# Altium project GUITAR.PrjPCB
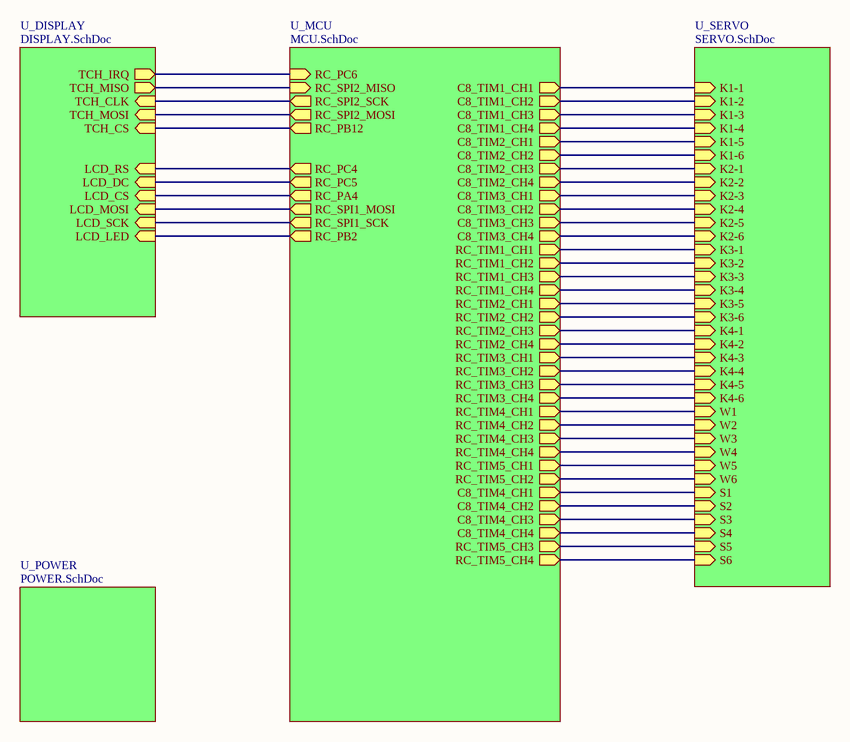
[diagram p0: CONN.SchDoc]
5 sheets, 103 parts. Net scope: hierarchical (ports join the sheet entries above them; power ports are global).
Board file: GUITAR.PcbDoc
Sheets:
  CONN.SchDoc
    U_DISPLAY = DISPLAY.SchDoc
    U_MCU = MCU.SchDoc
    U_POWER = POWER.SchDoc
    U_SERVO = SERVO.SchDoc

## Sheet CONN.SchDoc: =ProjectName
size A4; CheckedBy: DatNB; Author: Ven; CompanyName: Nacentech; Organization: IMET

### Sub-sheets
U_DISPLAY = DISPLAY.SchDoc: TCH_CLK (in), TCH_MISO (out), TCH_IRQ (out), LCD_MOSI (in), LCD_RS (in), LCD_DC (in), LCD_SCK (in), LCD_LED (in), TCH_MOSI (in), TCH_CS (in), LCD_CS (in)
U_MCU = MCU.SchDoc: RC_TIM3_CH4 (out), RC_SPI2_SCK (out), RC_SPI1_MOSI (out), C8_TIM3_CH3 (out), RC_PA4 (out), RC_PB2 (out), RC_TIM2_CH4 (out), C8_TIM3_CH1 (out), RC_TIM4_CH1 (out), RC_PC5 (out), RC_TIM5_CH4 (out), C8_TIM1_CH4 (out), RC_TIM3_CH2 (out), RC_PC4 (out), RC_TIM5_CH1 (out), C8_TIM1_CH1 (out), RC_PC6 (in), C8_TIM2_CH2 (out), RC_SPI2_MOSI (out), RC_SPI1_SCK (out), RC_TIM4_CH3 (out), RC_TIM2_CH2 (out), RC_TIM4_CH2 (out), C8_TIM1_CH3 (out), RC_TIM3_CH3 (out), RC_TIM4_CH4 (out), RC_TIM3_CH1 (out), RC_TIM5_CH3 (out), RC_PB12 (out), C8_TIM1_CH2 (out), C8_TIM2_CH3 (out), C8_TIM2_CH4 (out), C8_TIM3_CH2 (out), C8_TIM2_CH1 (out), C8_TIM3_CH4 (out), C8_TIM4_CH4 (out), C8_TIM4_CH2 (out), C8_TIM4_CH1 (out), C8_TIM4_CH3 (out), RC_TIM1_CH2 (out), RC_TIM1_CH3 (out), RC_TIM1_CH4 (out), RC_TIM1_CH1 (out), RC_TIM2_CH3 (out), RC_TIM2_CH1 (out), RC_TIM5_CH2 (out), RC_SPI2_MISO (in)
U_POWER = POWER.SchDoc: no entries
U_SERVO = SERVO.SchDoc: K1-1 (in), K1-2 (in), K1-3 (in), K1-4 (in), K1-5 (in), K1-6 (in), K2-1 (in), K2-2 (in), K2-3 (in), K2-4 (in), K2-5 (in), K2-6 (in), K3-1 (in), K3-2 (in), K3-3 (in), K3-4 (in), K3-5 (in), K3-6 (in), K4-1 (in), K4-2 (in), K4-3 (in), K4-4 (in), K4-5 (in), K4-6 (in), W1 (in), W2 (in), W3 (in), W4 (in), W5 (in), W6 (in), S1 (in), S2 (in), S3 (in), S4 (in), S5 (in), S6 (in)

### Nets
NetJ7_1: sheet U_MCU/C8_TIM1_CH2, sheet U_SERVO/K1-2
NetJ7_6: sheet U_MCU/C8_TIM1_CH1, sheet U_SERVO/K1-1
NetJ8_1: sheet U_MCU/C8_TIM1_CH4, sheet U_SERVO/K1-4
NetJ8_6: sheet U_MCU/C8_TIM1_CH3, sheet U_SERVO/K1-3
NetJ9_1: sheet U_MCU/C8_TIM2_CH2, sheet U_SERVO/K1-6
NetJ9_6: sheet U_MCU/C8_TIM2_CH1, sheet U_SERVO/K1-5
NetJ10_1: sheet U_MCU/C8_TIM2_CH4, sheet U_SERVO/K2-2
NetJ10_6: sheet U_MCU/C8_TIM2_CH3, sheet U_SERVO/K2-1
NetJ11_1: sheet U_MCU/C8_TIM3_CH2, sheet U_SERVO/K2-4
NetJ11_6: sheet U_MCU/C8_TIM3_CH1, sheet U_SERVO/K2-3
NetJ12_1: sheet U_MCU/C8_TIM4_CH2, sheet U_SERVO/S2
NetJ12_6: sheet U_MCU/C8_TIM4_CH1, sheet U_SERVO/S1
NetJ13_1: sheet U_MCU/C8_TIM3_CH4, sheet U_SERVO/K2-6
NetJ13_6: sheet U_MCU/C8_TIM3_CH3, sheet U_SERVO/K2-5
NetJ14_1: sheet U_MCU/RC_TIM1_CH2, sheet U_SERVO/K3-2
NetJ14_6: sheet U_MCU/RC_TIM1_CH1, sheet U_SERVO/K3-1
NetJ15_1: sheet U_MCU/RC_TIM1_CH4, sheet U_SERVO/K3-4
NetJ15_6: sheet U_MCU/RC_TIM1_CH3, sheet U_SERVO/K3-3
NetJ16_1: sheet U_MCU/RC_TIM2_CH2, sheet U_SERVO/K3-6
NetJ16_6: sheet U_MCU/RC_TIM2_CH1, sheet U_SERVO/K3-5
NetJ17_1: sheet U_MCU/RC_TIM2_CH4, sheet U_SERVO/K4-2
NetJ17_6: sheet U_MCU/RC_TIM2_CH3, sheet U_SERVO/K4-1
NetJ18_1: sheet U_MCU/C8_TIM4_CH4, sheet U_SERVO/S4
NetJ18_6: sheet U_MCU/C8_TIM4_CH3, sheet U_SERVO/S3
NetJ19_1: sheet U_MCU/RC_TIM3_CH2, sheet U_SERVO/K4-4
NetJ19_6: sheet U_MCU/RC_TIM3_CH1, sheet U_SERVO/K4-3
NetJ20_1: sheet U_MCU/RC_TIM3_CH4, sheet U_SERVO/K4-6
NetJ20_6: sheet U_MCU/RC_TIM3_CH3, sheet U_SERVO/K4-5
NetJ21_1: sheet U_MCU/RC_TIM4_CH2, sheet U_SERVO/W2
NetJ21_6: sheet U_MCU/RC_TIM4_CH1, sheet U_SERVO/W1
NetJ22_1: sheet U_MCU/RC_TIM4_CH4, sheet U_SERVO/W4
NetJ22_6: sheet U_MCU/RC_TIM4_CH3, sheet U_SERVO/W3
NetJ23_1: sheet U_MCU/RC_TIM5_CH2, sheet U_SERVO/W6
NetJ23_6: sheet U_MCU/RC_TIM5_CH1, sheet U_SERVO/W5
NetJ24_1: sheet U_MCU/RC_TIM5_CH4, sheet U_SERVO/S6
NetJ24_6: sheet U_MCU/RC_TIM5_CH3, sheet U_SERVO/S5
NetJP1_3: sheet U_DISPLAY/LCD_CS, sheet U_MCU/RC_PA4
NetJP1_4: sheet U_DISPLAY/LCD_RS, sheet U_MCU/RC_PC4
NetJP1_5: sheet U_DISPLAY/LCD_DC, sheet U_MCU/RC_PC5
NetJP1_6: sheet U_DISPLAY/LCD_MOSI, sheet U_MCU/RC_SPI1_MOSI
NetJP1_7: sheet U_DISPLAY/LCD_SCK, sheet U_MCU/RC_SPI1_SCK
NetJP1_8: sheet U_DISPLAY/LCD_LED, sheet U_MCU/RC_PB2
NetJP2_1: sheet U_DISPLAY/TCH_CLK, sheet U_MCU/RC_SPI2_SCK
NetJP2_2: sheet U_DISPLAY/TCH_CS, sheet U_MCU/RC_PB12
NetJP2_3: sheet U_DISPLAY/TCH_MOSI, sheet U_MCU/RC_SPI2_MOSI
NetJP2_4: sheet U_DISPLAY/TCH_MISO, sheet U_MCU/RC_SPI2_MISO
NetJP2_5: sheet U_DISPLAY/TCH_IRQ, sheet U_MCU/RC_PC6

### Notes on the sheet
- Project:
- Page Contents:
- Size:
- Date:
- A4
- Checked by:
- Time:
- Revision:
- Sheet
- of
- File:

## Sheet DISPLAY.SchDoc: =ProjectName
size A4; CheckedBy: DatNB; Author: Ven; CompanyName: Nacentech; Organization: IMET
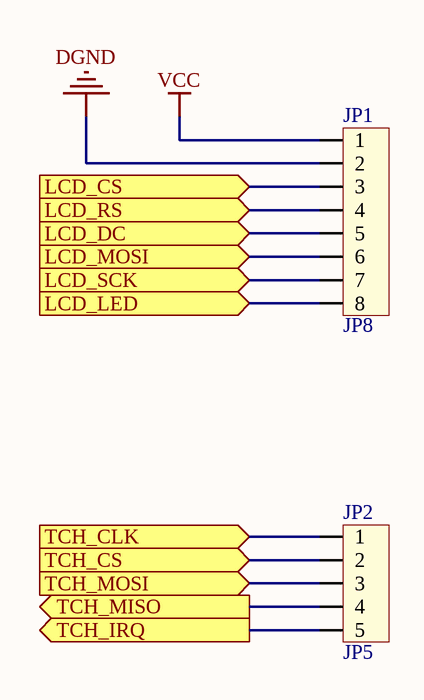
[diagram p1: DISPLAY.SchDoc]

### Parts
JP1  JP8  [CON8]
JP2  JP5  [CON5]

### Ports
LCD_CS (in), LCD_DC (in), LCD_LED (in), LCD_MOSI (in), LCD_RS (in), LCD_SCK (in), TCH_CLK (in), TCH_CS (in), TCH_IRQ (out), TCH_MISO (out), TCH_MOSI (in)

### Nets
DGND: JP1.2
VCC: JP1.1
NetJP1_3: JP1.3 ; port LCD_CS
NetJP1_4: JP1.4 ; port LCD_RS
NetJP1_5: JP1.5 ; port LCD_DC
NetJP1_6: JP1.6 ; port LCD_MOSI
NetJP1_7: JP1.7 ; port LCD_SCK
NetJP1_8: JP1.8 ; port LCD_LED
NetJP2_1: JP2.1 ; port TCH_CLK
NetJP2_2: JP2.2 ; port TCH_CS
NetJP2_3: JP2.3 ; port TCH_MOSI
NetJP2_4: JP2.4 ; port TCH_MISO
NetJP2_5: JP2.5 ; port TCH_IRQ

### Notes on the sheet
- Project:
- Page Contents:
- Size:
- Date:
- A4
- Checked by:
- Time:
- Revision:
- Sheet
- of
- File:

### Library data of the parts
JP1 = Con8: Connector 8; Value: Connector 8
JP2 = Con5: Connector 5; Value: Connector 5

## Sheet MCU.SchDoc: =ProjectName
size A3; Author: Ven
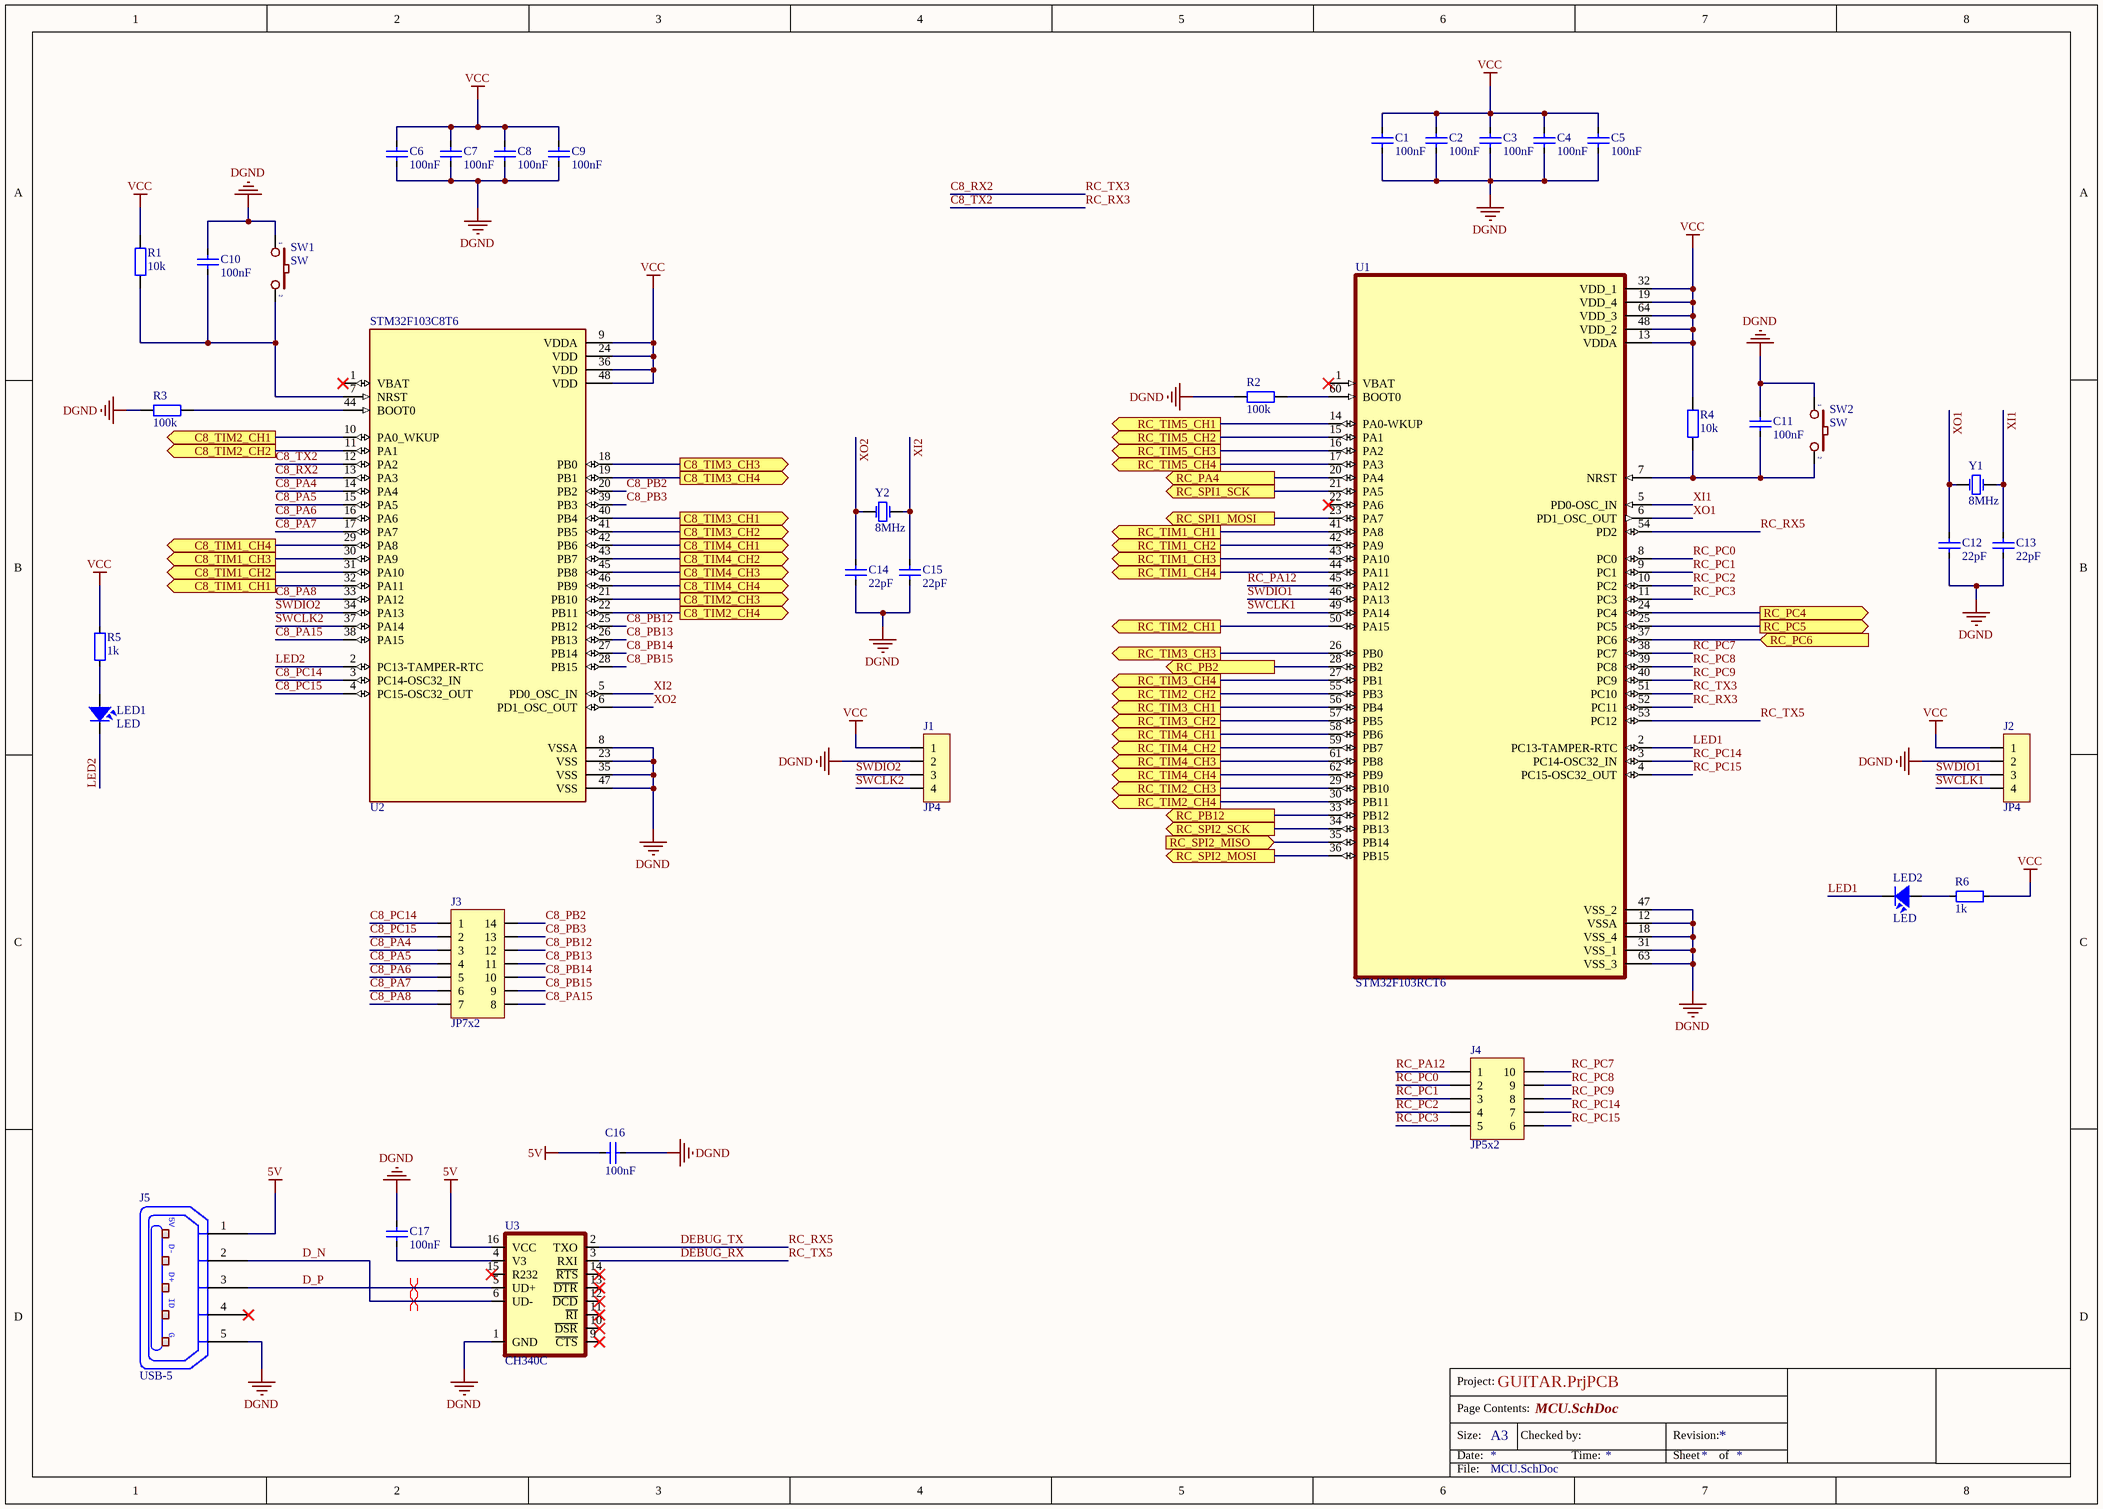
[diagram p2: MCU.SchDoc]

### Parts
C1  100nF  [CAP_0805]
C2  100nF  [CAP_0805]
C3  100nF  [CAP_0805]
C4  100nF  [CAP_0805]
C5  100nF  [CAP_0805]
C6  100nF  [CAP_0805]
C7  100nF  [CAP_0805]
C8  100nF  [CAP_0805]
C9  100nF  [CAP_0805]
C10  100nF  [CAP_0805]
C11  100nF  [CAP_0805]
C12  22pF  [CAP_0805]
C13  22pF  [CAP_0805]
C14  22pF  [CAP_0805]
C15  22pF  [CAP_0805]
C16  100nF  [CAP_0805]
C17  100nF  [CAP_0805]
J1  JP4  [JP4-C1T]
J2  JP4  [JP4-C1T]
J3  JP7x2  [JP7-D2T]
J4  JP5x2  [JP5-D2T]
J5  USB-5  [USB-M1]
LED1  LED  [LED-0805-Green]
LED2  LED  [LED-0805-Green]
R1  10k  [RES-SMD-0805]
R2  100k  [RES-SMD-0805]
R3  100k  [RES-SMD-0805]
R4  10k  [RES-SMD-0805]
R5  1k  [RES-SMD-0805]
R6  1k  [RES-SMD-0805]
SW1  SW  [SW 3x2x4]
SW2  SW  [SW 3x2x4]
U1  STM32F103RCT6  [QFP50P1200X1200X160-64N]
U2  STM32F103C8T6  [LQFP 48]
U3  CH340C  [SO016]
Y1  8MHz  [XTAL 5032 SMD]
Y2  8MHz  [XTAL 5032 SMD]

### Ports
C8_TIM1_CH1 (out), C8_TIM1_CH2 (out), C8_TIM1_CH3 (out), C8_TIM1_CH4 (out), C8_TIM2_CH1 (out), C8_TIM2_CH2 (out), C8_TIM2_CH3 (out), C8_TIM2_CH4 (out), C8_TIM3_CH1 (out), C8_TIM3_CH2 (out), C8_TIM3_CH3 (out), C8_TIM3_CH4 (out), C8_TIM4_CH1 (out), C8_TIM4_CH2 (out), C8_TIM4_CH3 (out), C8_TIM4_CH4 (out), RC_PA4 (out), RC_PB2 (out), RC_PB12 (out), RC_PC4 (out), RC_PC5 (out), RC_PC6 (in), RC_SPI1_MOSI (out), RC_SPI1_SCK (out), RC_SPI2_MISO (in), RC_SPI2_MOSI (out), RC_SPI2_SCK (out), RC_TIM1_CH1 (out), RC_TIM1_CH2 (out), RC_TIM1_CH3 (out), RC_TIM1_CH4 (out), RC_TIM2_CH1 (out), RC_TIM2_CH2 (out), RC_TIM2_CH3 (out), RC_TIM2_CH4 (out), RC_TIM3_CH1 (out), RC_TIM3_CH2 (out), RC_TIM3_CH3 (out), RC_TIM3_CH4 (out), RC_TIM4_CH1 (out), RC_TIM4_CH2 (out), RC_TIM4_CH3 (out), RC_TIM4_CH4 (out), RC_TIM5_CH1 (out), RC_TIM5_CH2 (out), RC_TIM5_CH3 (out), RC_TIM5_CH4 (out)

### Nets
5V: C16.2 J5.1(P1) U3.16(VCC)
DGND: C1.2 C2.2 C3.2 C4.2 C5.2 C6.2 C7.2 C8.2 C9.2 C10.1 C11.1 C12.1 C13.1 C14.1 C15.1 C16.1 C17.2 J1.2 J2.2 J5.5(P5) R2.1 R3.1 SW1.1 SW2.1 U1.12(VSSA) U1.18(VSS_4) U1.31(VSS_1) U1.47(VSS_2) U1.63(VSS_3) U2.8(VSSA) U2.23(VSS) U2.35(VSS) U2.47(VSS) U3.1(GND)
VCC: C1.1 C2.1 C3.1 C4.1 C5.1 C6.1 C7.1 C8.1 C9.1 J1.1 J2.1 R1.1 R4.1 R5.1 R6.1 U1.13(VDDA) U1.19(VDD_4) U1.32(VDD_1) U1.48(VDD_2) U1.64(VDD_3) U2.9(VDDA) U2.24(VDD) U2.36(VDD) U2.48(VDD)
C8_PA4: J3.3 U2.14(PA4)
C8_PA5: J3.4 U2.15(PA5)
C8_PA6: J3.5 U2.16(PA6)
C8_PA7: J3.6 U2.17(PA7)
C8_PA8: J3.7 U2.33(PA12)
C8_PA15: J3.8 U2.38(PA15)
C8_PB2: J3.14 U2.20(PB2)
C8_PB3: J3.13 U2.39(PB3)
C8_PB12: J3.12 U2.25(PB12)
C8_PB13: J3.11 U2.26(PB13)
C8_PB14: J3.10 U2.27(PB14)
C8_PB15: J3.9 U2.28(PB15)
C8_PC14: J3.1 U2.3(PC14-OSC32_IN)
C8_PC15: J3.2 U2.4(PC15-OSC32_OUT)
C8_RX2: U1.51(PC10) U2.13(PA3)  [also labelled RC_TX3]
C8_TX2: U1.52(PC11) U2.12(PA2)  [also labelled RC_RX3]
D_N: J5.2(P2) U3.6(UD-)
D_P: J5.3(P3) U3.5(UD+)
DEBUG_RX: U1.53(PC12) U3.3(RXI)  [also labelled RC_TX5]
DEBUG_TX: U1.54(PD2) U3.2(TXO)  [also labelled RC_RX5]
LED1: LED2.2 U1.2(PC13-TAMPER-RTC)
LED2: LED1.2 U2.2(PC13-TAMPER-RTC)
RC_PA12: J4.1 U1.45(PA12)
RC_PC0: J4.2 U1.8(PC0)
RC_PC1: J4.3 U1.9(PC1)
RC_PC2: J4.4 U1.10(PC2)
RC_PC3: J4.5 U1.11(PC3)
RC_PC7: J4.10 U1.38(PC7)
RC_PC8: J4.9 U1.39(PC8)
RC_PC9: J4.8 U1.40(PC9)
RC_PC14: J4.7 U1.3(PC14-OSC32_IN)
RC_PC15: J4.6 U1.4(PC15-OSC32_OUT)
SWCLK1: J2.4 U1.49(PA14)
SWCLK2: J1.4 U2.37(PA14)
SWDIO1: J2.3 U1.46(PA13)
SWDIO2: J1.3 U2.34(PA13)
XI1: C13.2 U1.5(PD0-OSC_IN) Y1.2(OSC2)
XI2: C15.2 U2.5(PD0_OSC_IN) Y2.2(OSC2)
XO1: C12.2 U1.6(PD1_OSC_OUT) Y1.1(OSC1)
XO2: C14.2 U2.6(PD1_OSC_OUT) Y2.1(OSC1)
NetC10_2: C10.2 R1.2 SW1.2 U2.7(NRST)
NetC11_2: C11.2 R4.2 SW2.2 U1.7(NRST)
NetC17_1: C17.1 U3.4(V3)
NetJ7_1: U2.31(PA10) ; port C8_TIM1_CH2
NetJ7_6: U2.32(PA11) ; port C8_TIM1_CH1
NetJ8_1: U2.29(PA8) ; port C8_TIM1_CH4
NetJ8_6: U2.30(PA9) ; port C8_TIM1_CH3
NetJ9_1: U2.11(PA1) ; port C8_TIM2_CH2
NetJ9_6: U2.10(PA0_WKUP) ; port C8_TIM2_CH1
NetJ10_1: U2.22(PB11) ; port C8_TIM2_CH4
NetJ10_6: U2.21(PB10) ; port C8_TIM2_CH3
NetJ11_1: U2.41(PB5) ; port C8_TIM3_CH2
NetJ11_6: U2.40(PB4) ; port C8_TIM3_CH1
NetJ12_1: U2.43(PB7) ; port C8_TIM4_CH2
NetJ12_6: U2.42(PB6) ; port C8_TIM4_CH1
NetJ13_1: U2.19(PB1) ; port C8_TIM3_CH4
NetJ13_6: U2.18(PB0) ; port C8_TIM3_CH3
NetJ14_1: U1.42(PA9) ; port RC_TIM1_CH2
NetJ14_6: U1.41(PA8) ; port RC_TIM1_CH1
NetJ15_1: U1.44(PA11) ; port RC_TIM1_CH4
NetJ15_6: U1.43(PA10) ; port RC_TIM1_CH3
NetJ16_1: U1.55(PB3) ; port RC_TIM2_CH2
NetJ16_6: U1.50(PA15) ; port RC_TIM2_CH1
NetJ17_1: U1.30(PB11) ; port RC_TIM2_CH4
NetJ17_6: U1.29(PB10) ; port RC_TIM2_CH3
NetJ18_1: U2.46(PB9) ; port C8_TIM4_CH4
NetJ18_6: U2.45(PB8) ; port C8_TIM4_CH3
NetJ19_1: U1.57(PB5) ; port RC_TIM3_CH2
NetJ19_6: U1.56(PB4) ; port RC_TIM3_CH1
NetJ20_1: U1.27(PB1) ; port RC_TIM3_CH4
NetJ20_6: U1.26(PB0) ; port RC_TIM3_CH3
NetJ21_1: U1.59(PB7) ; port RC_TIM4_CH2
NetJ21_6: U1.58(PB6) ; port RC_TIM4_CH1
NetJ22_1: U1.62(PB9) ; port RC_TIM4_CH4
NetJ22_6: U1.61(PB8) ; port RC_TIM4_CH3
NetJ23_1: U1.15(PA1) ; port RC_TIM5_CH2
NetJ23_6: U1.14(PA0-WKUP) ; port RC_TIM5_CH1
NetJ24_1: U1.17(PA3) ; port RC_TIM5_CH4
NetJ24_6: U1.16(PA2) ; port RC_TIM5_CH3
NetJP1_3: U1.20(PA4) ; port RC_PA4
NetJP1_4: U1.24(PC4) ; port RC_PC4
NetJP1_5: U1.25(PC5) ; port RC_PC5
NetJP1_6: U1.23(PA7) ; port RC_SPI1_MOSI
NetJP1_7: U1.21(PA5) ; port RC_SPI1_SCK
NetJP1_8: U1.28(PB2) ; port RC_PB2
NetJP2_1: U1.34(PB13) ; port RC_SPI2_SCK
NetJP2_2: U1.33(PB12) ; port RC_PB12
NetJP2_3: U1.36(PB15) ; port RC_SPI2_MOSI
NetJP2_4: U1.35(PB14) ; port RC_SPI2_MISO
NetJP2_5: U1.37(PC6) ; port RC_PC6
NetLED1_1: LED1.1 R5.2
NetLED2_1: LED2.1 R6.2
NetR2_2: R2.2 U1.60(BOOT0)
NetR3_2: R3.2 U2.44(BOOT0)

Not connected (* = marked no-connect by the designer): J5 4(P4)*; U1 1(VBAT)* 22(PA6)*; U2 1(VBAT)*; U3 9(~{CTS})* 10(~{DSR})* 11(~{RI})* 12(~{DCD})* 13(~{DTR})* 14(~{RTS})* 15(R232)*

### Layout directives
differential pair: D_N, D_P

### Notes on the sheet
- Project:
- Page Contents:
- Size:
- Date:
- A3
- Checked by:
- Time:
- Revision:
- Sheet
- of
- File:
- (in symbol USB-5) 5V; D-; D+; ID; G

### Library data of the parts
C1-C17 = CapSMD: Capacitor; Value: 33p; Published: 8-Jun-2000; LatestRevisionDate: 17-Jul-2002; LatestRevisionNote: Re-released for DXP Platform.; PackageReference: RAD-0.3; Publisher: Altium Limited
J1 J2 = JP4: WR-PHD 2.54 mm Angled Socket Header; Manufacturer: W¨¹rth Elektronik eiSos GmbH; partNo: 613004143121; ComponentLink1 Description: Manufacturer; ComponentLink2 Description: Datasheet; NoPins: 04; Created Date: 29 March 2013; ComponentLink1URL: http://www.we-online.com; ComponentLink2URL: http://katalog.we-online.de/em/datasheet/6130xx143121.pdf; Created by: Karrer Zheng
J3 = JP7x2: WR-PHD 2.54 mm Dual Socket Header; Manufacturer: W¨¹rth Elektronik eiSos GmbH; partNo: 61301421821; ComponentLink1 Description: Manufacturer; ComponentLink2 Description: Datasheet; NoPins: 14; Created Date: 29 March 2013; ComponentLink1URL: http://www.we-online.com; ComponentLink2URL: http://katalog.we-online.de/em/datasheet/6130xx21821.pdf; Created by: Karrer Zheng
J4 = JP5x2: WR-PHD 2.54 mm Dual Socket Header; Manufacturer: W¨¹rth Elektronik eiSos GmbH; partNo: 61301021821; ComponentLink1 Description: Manufacturer; ComponentLink2 Description: Datasheet; NoPins: 10; Created Date: 29 March 2013; ComponentLink1URL: http://www.we-online.com; ComponentLink2URL: http://katalog.we-online.de/em/datasheet/6130xx21821.pdf; Created by: Karrer Zheng
J5 = USB-5: Manufacturer: FCI; Manufacturer Part Number: 10118193-0001LF; Connector Type: USB - micro B; Number of Contacts: 5; Gender: Receptacle; Specifications: USB 2.0; .Creator: MM; .Checked PCB: RF; Supplier 1: Digi-Key; RoHS: RoHS Compliant; Category: Connectors, Interconnects; Stock 1: 28642; Pricing 1: 1=0.46, 10=0.433, 25=0.3712, 50=0.3156, 100=0.3032, 250=0.27224, 500=0.25988 (USD); Packaging: Cut Tape (CT); Mounting Type: Surface Mount, Right Angle, Horizontal; Features: Shielded, Solder Retention; Ingress Protection: -; ComponentLink1URL: http://portal.fciconnect.com/Comergent//fci/drawing/10118193.pdf; ComponentLink1Description: http://portal.fciconnect.com/Comergent//fci/drawing/10118193.pdf; Supplier Part Number 1: 609-4616-1-ND; .Checked SCH: MM
LED1 LED2 = LED: LED Single colour Green and Red; Value: LED 3 ly Single Colour
R1-R4 = Resistor - SMD: Resistor SMD; Manufacturer: Generic Components; Class: Passive; Published: 08/06/2000; Publisher: Altium Hobart Technology Centre
R5 R6 = Resistor - SMD: Resistor; Manufacturer: Generic Components; Class: Passive; Published: 08/06/2000; Publisher: Altium Hobart Technology Centre
SW1 SW2 = SW2: Switch button 2 pin; Value: SW chip 2 pin
U1 = STM32F103RCT6: STM32 ARM-based 32-bit MCU 72MHz 256KB
U2 = STM32F103C8T6: STM32 ARM-based 32-bit MCU with 64 Kbytes Flash, 64-pin LQFP, Industrial Temperature
U3 = CH340C: USB to serial chip CH340; MF: WCH; Package: Package; Check_prices: https://www.snapeda.com/parts/CH340C/WCH/view-part/5428851/?ref=eda; Value: *; Price: None; MP: CH340C; Availability: Unavailable; SnapEDA_Link: https://www.snapeda.com/parts/CH340C/WCH/view-part/5428851/?ref=snap
Y1 Y2 = XTAL: Crystal Oscillator; Published: 8-Jun-2000; LatestRevisionDate: 17-Jul-2002; LatestRevisionNote: Re-released for DXP Platform.; PackageReference: R38; Publisher: Altium Limited

## Sheet POWER.SchDoc: =ProjectName
size A3; Author: Ven
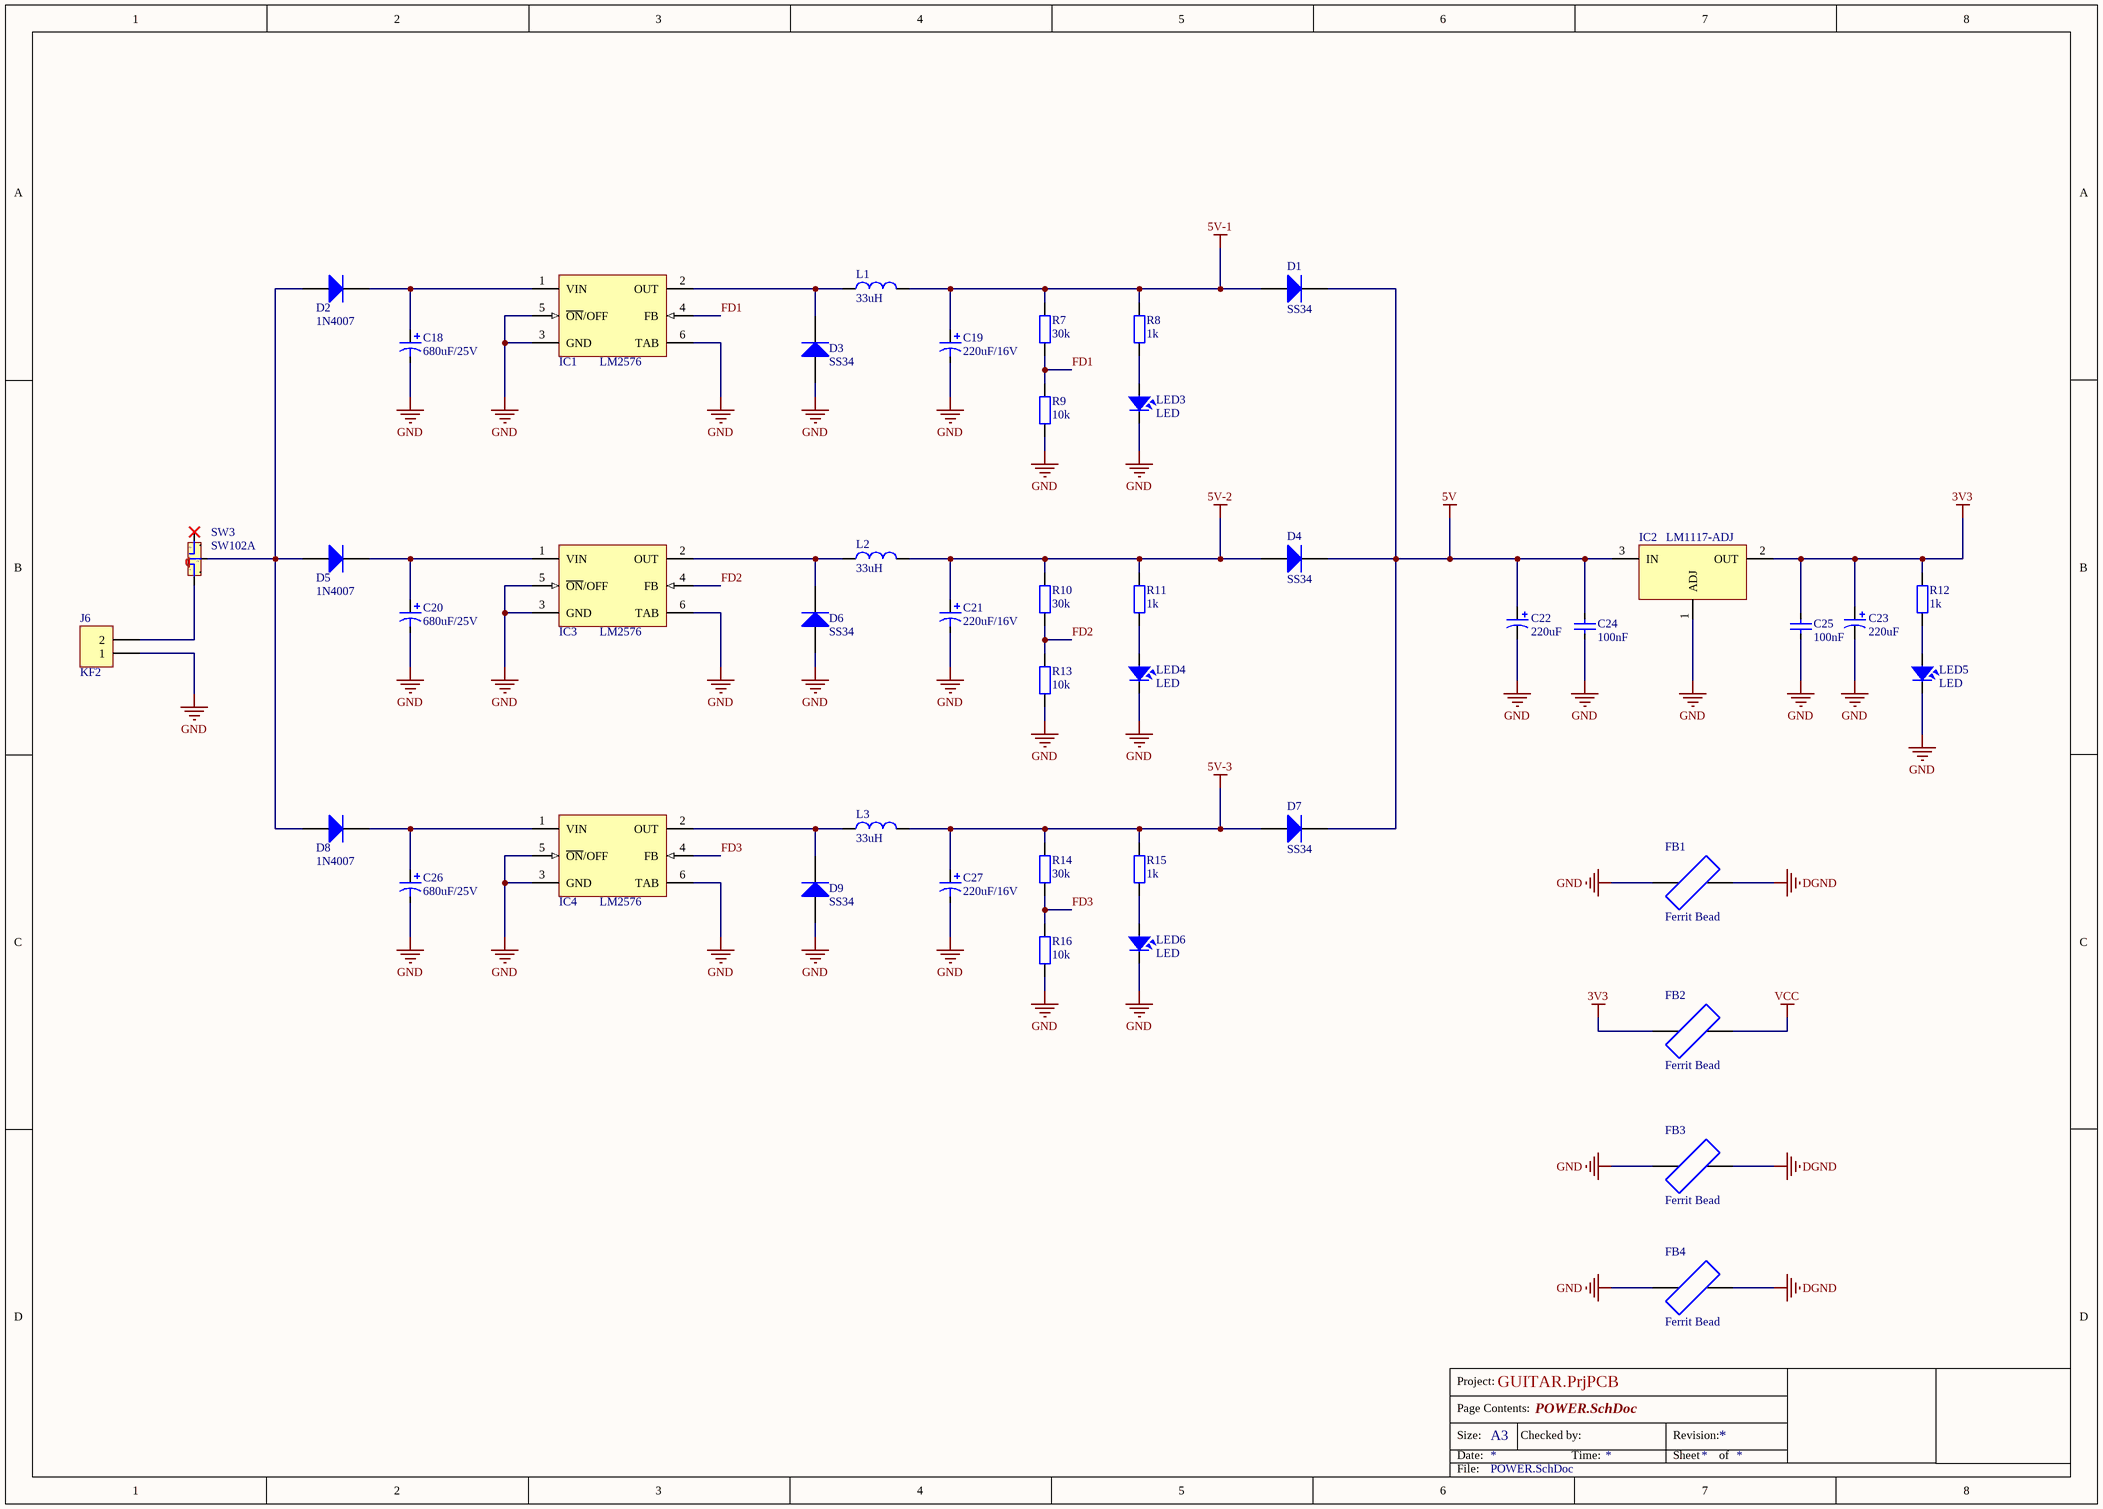
[diagram p3: POWER.SchDoc]

### Parts
C18  680uF/25V  [C10mm]
C19  220uF/16V  [C5mm]
C20  680uF/25V  [C10mm]
C21  220uF/16V  [C5mm]
C22  220uF  [CAP_7343]
C23  220uF  [CAP_7343]
C24  100nF  [CAP_0805]
C25  100nF  [CAP_0805]
C26  680uF/25V  [C10mm]
C27  220uF/16V  [C5mm]
D1  SS34  [DO-214AC(SMA)]
D2  1N4007  [DO-214AC(SMA)]
D3  SS34  [DO-214AC(SMA)]
D4  SS34  [DO-214AC(SMA)]
D5  1N4007  [DO-214AC(SMA)]
D6  SS34  [DO-214AC(SMA)]
D7  SS34  [DO-214AC(SMA)]
D8  1N4007  [DO-214AC(SMA)]
D9  SS34  [DO-214AC(SMA)]
FB1  Ferrit Bead  [RES-SMD-0805]
FB2  Ferrit Bead  [RES-SMD-0805]
FB3  Ferrit Bead  [RES-SMD-0805]
FB4  Ferrit Bead  [RES-SMD-0805]
IC1  LM2576  [TO263-5]
IC2  LM1117-ADJ  [LM1117-SOP]
IC3  LM2576  [TO263-5]
IC4  LM2576  [TO263-5]
J6  KF2  [KF2-5.08T]
L1  33uH  [L-SMD-M-12x10]
L2  33uH  [L-SMD-M-12x10]
L3  33uH  [L-SMD-M-12x10]
LED3  LED  [LED-0805-Red]
LED4  LED  [LED-0805-Red]
LED5  LED  [LED-0805-Blue]
LED6  LED  [LED-0805-Red]
R7  30k  [RES-SMD-0805]
R8  1k  [RES-SMD-0805]
R9  10k  [RES-SMD-0805]
R10  30k  [RES-SMD-0805]
R11  1k  [RES-SMD-0805]
R12  1k  [RES-SMD-0805]
R13  10k  [RES-SMD-0805]
R14  30k  [RES-SMD-0805]
R15  1k  [RES-SMD-0805]
R16  10k  [RES-SMD-0805]
SW3  SW102A  [SW102]

### Nets
3V3: C23.1 C25.2 FB2.1 IC2.2(OUT) R12.1
5V: C22.1 C24.2 D1.2(K) D4.2(K) D7.2(K) IC2.3(IN)
5V-1: C19.1 D1.1(A) L1.2 R7.1 R8.1
5V-2: C21.1 D4.1(A) L2.2 R10.1 R11.1
5V-3: C27.1 D7.1(A) L3.2 R14.1 R15.1
DGND: FB1.2 FB3.2 FB4.2
GND: C18.2 C19.2 C20.2 C21.2 C22.2 C23.2 C24.1 C25.1 C26.2 C27.2 D3.1(A) D6.1(A) D9.1(A) FB1.1 FB3.1 FB4.1 IC1.3(GND) IC1.5(~{ON}/OFF) IC1.6(TAB) IC2.1(ADJ) IC3.3(GND) IC3.5(~{ON}/OFF) IC3.6(TAB) IC4.3(GND) IC4.5(~{ON}/OFF) IC4.6(TAB) J6.1 LED3.2 LED4.2 LED5.2 LED6.2 R9.2 R13.2 R16.2
VCC: FB2.2
FD1: IC1.4(FB) R7.2 R9.1
FD2: IC3.4(FB) R10.2 R13.1
FD3: IC4.4(FB) R14.2 R16.1
NetC18_1: C18.1 D2.2(K) IC1.1(VIN)
NetC20_1: C20.1 D5.2(K) IC3.1(VIN)
NetC26_1: C26.1 D8.2(K) IC4.1(VIN)
NetD2_1: D2.1(A) D5.1(A) D8.1(A) SW3.2
NetD3_2: D3.2(K) IC1.2(OUT) L1.1
NetD6_2: D6.2(K) IC3.2(OUT) L2.1
NetD9_2: D9.2(K) IC4.2(OUT) L3.1
NetJ6_2: J6.2 SW3.1
NetLED3_1: LED3.1 R8.2
NetLED4_1: LED4.1 R11.2
NetLED5_1: LED5.1 R12.2
NetLED6_1: LED6.1 R15.2

Not connected (* = marked no-connect by the designer): SW3 3* 4 5

### Notes on the sheet
- Project:
- Page Contents:
- Size:
- Date:
- A3
- Checked by:
- Time:
- Revision:
- Sheet
- of
- File:

### Library data of the parts
C18-C21 C26 C27 = Cap Pol: Polarized Capacitor (Axial); Published: 8-Jun-2000; LatestRevisionDate: 17-Jul-2002; LatestRevisionNote: Re-released for DXP Platform.; PackageReference: POLAR0.8; Publisher: Altium Limited
C22 C23 = CAP_TAN_SMD: Polazied Tantalum Capacitor
C24 C25 = CapSMD: Capacitor; Value: 33p; Published: 8-Jun-2000; LatestRevisionDate: 17-Jul-2002; LatestRevisionNote: Re-released for DXP Platform.; PackageReference: RAD-0.3; Publisher: Altium Limited
D1-D9 = Diode SMD: Default Diode; Code - JEDEC: DO-214-AB; Value: 1N5007; Published: 8-Jun-2000; Revision: July-2002: Re-released for DXP Platform.; Publisher: Altium Limited
FB1-FB4 = Ferrit Bead: Generic Ferrit Bead
IC2 = LM1117-ADJ: 800mA Low-Dropout Linear Regulator; Creator: Nguyen Ba Bien; Website: http://group3i.net
J6 = KF2: Manufacturer: Würth Elektronik eiSos GmbH; partNo: 691103110002; ComponentLink1 Description: Manufacturer; ComponentLink2 Description: Datasheet; NoPins: 2; Created Date: 29 October 2013; ComponentLink1URL: http://www.we-online.com; ComponentLink2URL: http://katalog.we-online.de/em/datasheet/6911031100xx.pdf; Created by: Karrer Zheng
L1-L3 = Inductor: Value: 150 mH
LED3-LED6 = LED: as LED1 on sheet MCU
R7-R16 = Resistor - SMD: as R1 on sheet MCU; Published: 08/06/2000; Publisher: Altium Hobart Technology Centre
SW3 = SW102A: Switch 102 on Broad; Value: Switch 102 On Board

## Sheet SERVO.SchDoc: =ProjectName
size A4; CheckedBy: DatNB; Author: Ven; CompanyName: Nacentech; Organization: IMET
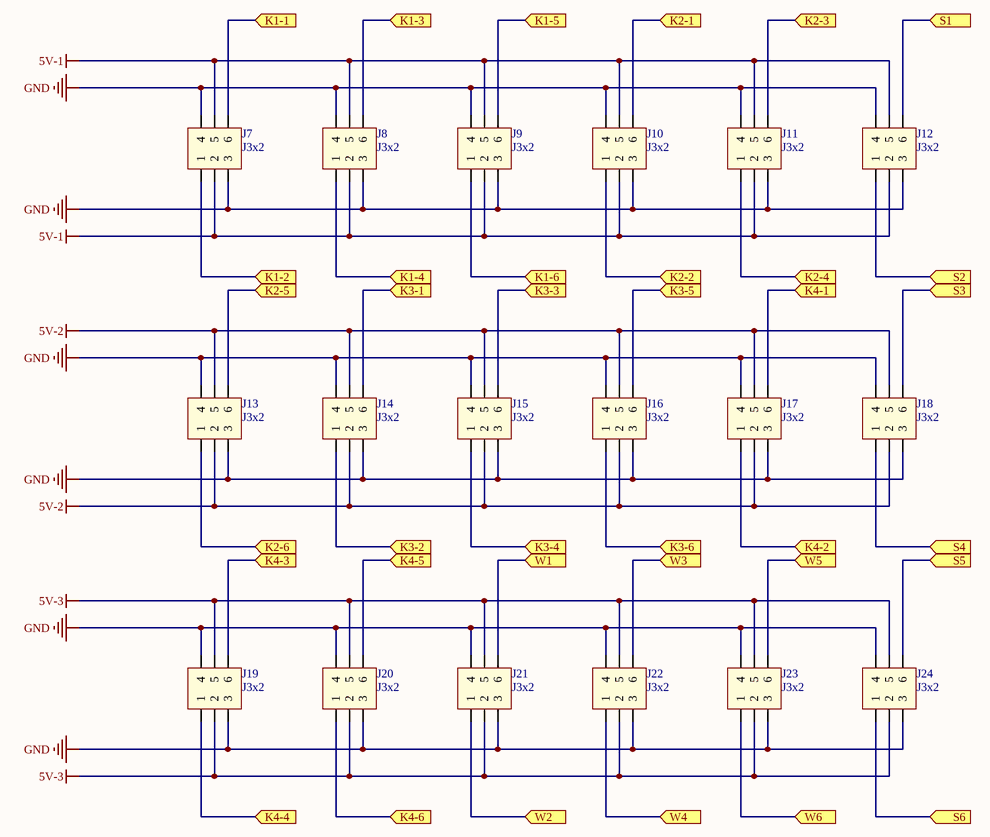
[diagram p4: SERVO.SchDoc]

### Parts
J7  J3x2  [J3-D2T]
J8  J3x2  [J3-D2T]
J9  J3x2  [J3-D2T]
J10  J3x2  [J3-D2T]
J11  J3x2  [J3-D2T]
J12  J3x2  [J3-D2T]
J13  J3x2  [J3-D2T]
J14  J3x2  [J3-D2T]
J15  J3x2  [J3-D2T]
J16  J3x2  [J3-D2T]
J17  J3x2  [J3-D2T]
J18  J3x2  [J3-D2T]
J19  J3x2  [J3-D2T]
J20  J3x2  [J3-D2T]
J21  J3x2  [J3-D2T]
J22  J3x2  [J3-D2T]
J23  J3x2  [J3-D2T]
J24  J3x2  [J3-D2T]

### Ports
K1-1 (in), K1-2 (in), K1-3 (in), K1-4 (in), K1-5 (in), K1-6 (in), K2-1 (in), K2-2 (in), K2-3 (in), K2-4 (in), K2-5 (in), K2-6 (in), K3-1 (in), K3-2 (in), K3-3 (in), K3-4 (in), K3-5 (in), K3-6 (in), K4-1 (in), K4-2 (in), K4-3 (in), K4-4 (in), K4-5 (in), K4-6 (in), S1 (in), S2 (in), S3 (in), S4 (in), S5 (in), S6 (in), W1 (in), W2 (in), W3 (in), W4 (in), W5 (in), W6 (in)

### Nets
5V-1: J7.2 J7.5 J8.2 J8.5 J9.2 J9.5 J10.2 J10.5 J11.2 J11.5 J12.2 J12.5
5V-2: J13.2 J13.5 J14.2 J14.5 J15.2 J15.5 J16.2 J16.5 J17.2 J17.5 J18.2 J18.5
5V-3: J19.2 J19.5 J20.2 J20.5 J21.2 J21.5 J22.2 J22.5 J23.2 J23.5 J24.2 J24.5
GND: J7.3 J7.4 J8.3 J8.4 J9.3 J9.4 J10.3 J10.4 J11.3 J11.4 J12.3 J12.4 J13.3 J13.4 J14.3 J14.4 J15.3 J15.4 J16.3 J16.4 J17.3 J17.4 J18.3 J18.4 J19.3 J19.4 J20.3 J20.4 J21.3 J21.4 J22.3 J22.4 J23.3 J23.4 J24.3 J24.4
NetJ7_1: J7.1 ; port K1-2
NetJ7_6: J7.6 ; port K1-1
NetJ8_1: J8.1 ; port K1-4
NetJ8_6: J8.6 ; port K1-3
NetJ9_1: J9.1 ; port K1-6
NetJ9_6: J9.6 ; port K1-5
NetJ10_1: J10.1 ; port K2-2
NetJ10_6: J10.6 ; port K2-1
NetJ11_1: J11.1 ; port K2-4
NetJ11_6: J11.6 ; port K2-3
NetJ12_1: J12.1 ; port S2
NetJ12_6: J12.6 ; port S1
NetJ13_1: J13.1 ; port K2-6
NetJ13_6: J13.6 ; port K2-5
NetJ14_1: J14.1 ; port K3-2
NetJ14_6: J14.6 ; port K3-1
NetJ15_1: J15.1 ; port K3-4
NetJ15_6: J15.6 ; port K3-3
NetJ16_1: J16.1 ; port K3-6
NetJ16_6: J16.6 ; port K3-5
NetJ17_1: J17.1 ; port K4-2
NetJ17_6: J17.6 ; port K4-1
NetJ18_1: J18.1 ; port S4
NetJ18_6: J18.6 ; port S3
NetJ19_1: J19.1 ; port K4-4
NetJ19_6: J19.6 ; port K4-3
NetJ20_1: J20.1 ; port K4-6
NetJ20_6: J20.6 ; port K4-5
NetJ21_1: J21.1 ; port W2
NetJ21_6: J21.6 ; port W1
NetJ22_1: J22.1 ; port W4
NetJ22_6: J22.6 ; port W3
NetJ23_1: J23.1 ; port W6
NetJ23_6: J23.6 ; port W5
NetJ24_1: J24.1 ; port S6
NetJ24_6: J24.6 ; port S5

### Notes on the sheet
- Project:
- Page Contents:
- Size:
- Date:
- A4
- Checked by:
- Time:
- Revision:
- Sheet
- of
- File:

### Library data of the parts
J7-J24 = JP3x2: Connector 3x2; Value: Connector 3x2

## Nets that join several sheets
5V: MCU (C16.2 J5.1 U3.16), POWER (6 pins)
5V-1: POWER (5 pins), SERVO (12 pins)
5V-2: POWER (5 pins), SERVO (12 pins)
5V-3: POWER (5 pins), SERVO (12 pins)
DGND: DISPLAY (JP1.2), MCU (34 pins), POWER (FB1.2 FB3.2 FB4.2)
GND: POWER (34 pins), SERVO (36 pins)
VCC: DISPLAY (JP1.1), MCU (24 pins), POWER (FB2.2)
NetJ7_1: MCU (U2.31), SERVO (J7.1)
NetJ7_6: MCU (U2.32), SERVO (J7.6)
NetJ8_1: MCU (U2.29), SERVO (J8.1)
NetJ8_6: MCU (U2.30), SERVO (J8.6)
NetJ9_1: MCU (U2.11), SERVO (J9.1)
NetJ9_6: MCU (U2.10), SERVO (J9.6)
NetJ10_1: MCU (U2.22), SERVO (J10.1)
NetJ10_6: MCU (U2.21), SERVO (J10.6)
NetJ11_1: MCU (U2.41), SERVO (J11.1)
NetJ11_6: MCU (U2.40), SERVO (J11.6)
NetJ12_1: MCU (U2.43), SERVO (J12.1)
NetJ12_6: MCU (U2.42), SERVO (J12.6)
NetJ13_1: MCU (U2.19), SERVO (J13.1)
NetJ13_6: MCU (U2.18), SERVO (J13.6)
NetJ14_1: MCU (U1.42), SERVO (J14.1)
NetJ14_6: MCU (U1.41), SERVO (J14.6)
NetJ15_1: MCU (U1.44), SERVO (J15.1)
NetJ15_6: MCU (U1.43), SERVO (J15.6)
NetJ16_1: MCU (U1.55), SERVO (J16.1)
NetJ16_6: MCU (U1.50), SERVO (J16.6)
NetJ17_1: MCU (U1.30), SERVO (J17.1)
NetJ17_6: MCU (U1.29), SERVO (J17.6)
NetJ18_1: MCU (U2.46), SERVO (J18.1)
NetJ18_6: MCU (U2.45), SERVO (J18.6)
NetJ19_1: MCU (U1.57), SERVO (J19.1)
NetJ19_6: MCU (U1.56), SERVO (J19.6)
NetJ20_1: MCU (U1.27), SERVO (J20.1)
NetJ20_6: MCU (U1.26), SERVO (J20.6)
NetJ21_1: MCU (U1.59), SERVO (J21.1)
NetJ21_6: MCU (U1.58), SERVO (J21.6)
NetJ22_1: MCU (U1.62), SERVO (J22.1)
NetJ22_6: MCU (U1.61), SERVO (J22.6)
NetJ23_1: MCU (U1.15), SERVO (J23.1)
NetJ23_6: MCU (U1.14), SERVO (J23.6)
NetJ24_1: MCU (U1.17), SERVO (J24.1)
NetJ24_6: MCU (U1.16), SERVO (J24.6)
NetJP1_3: DISPLAY (JP1.3), MCU (U1.20)
NetJP1_4: DISPLAY (JP1.4), MCU (U1.24)
NetJP1_5: DISPLAY (JP1.5), MCU (U1.25)
NetJP1_6: DISPLAY (JP1.6), MCU (U1.23)
NetJP1_7: DISPLAY (JP1.7), MCU (U1.21)
NetJP1_8: DISPLAY (JP1.8), MCU (U1.28)
NetJP2_1: DISPLAY (JP2.1), MCU (U1.34)
NetJP2_2: DISPLAY (JP2.2), MCU (U1.33)
NetJP2_3: DISPLAY (JP2.3), MCU (U1.36)
NetJP2_4: DISPLAY (JP2.4), MCU (U1.35)
NetJP2_5: DISPLAY (JP2.5), MCU (U1.37)